# EAGLE design Bi Directional Visitor Counter (EAGLE 6.1)
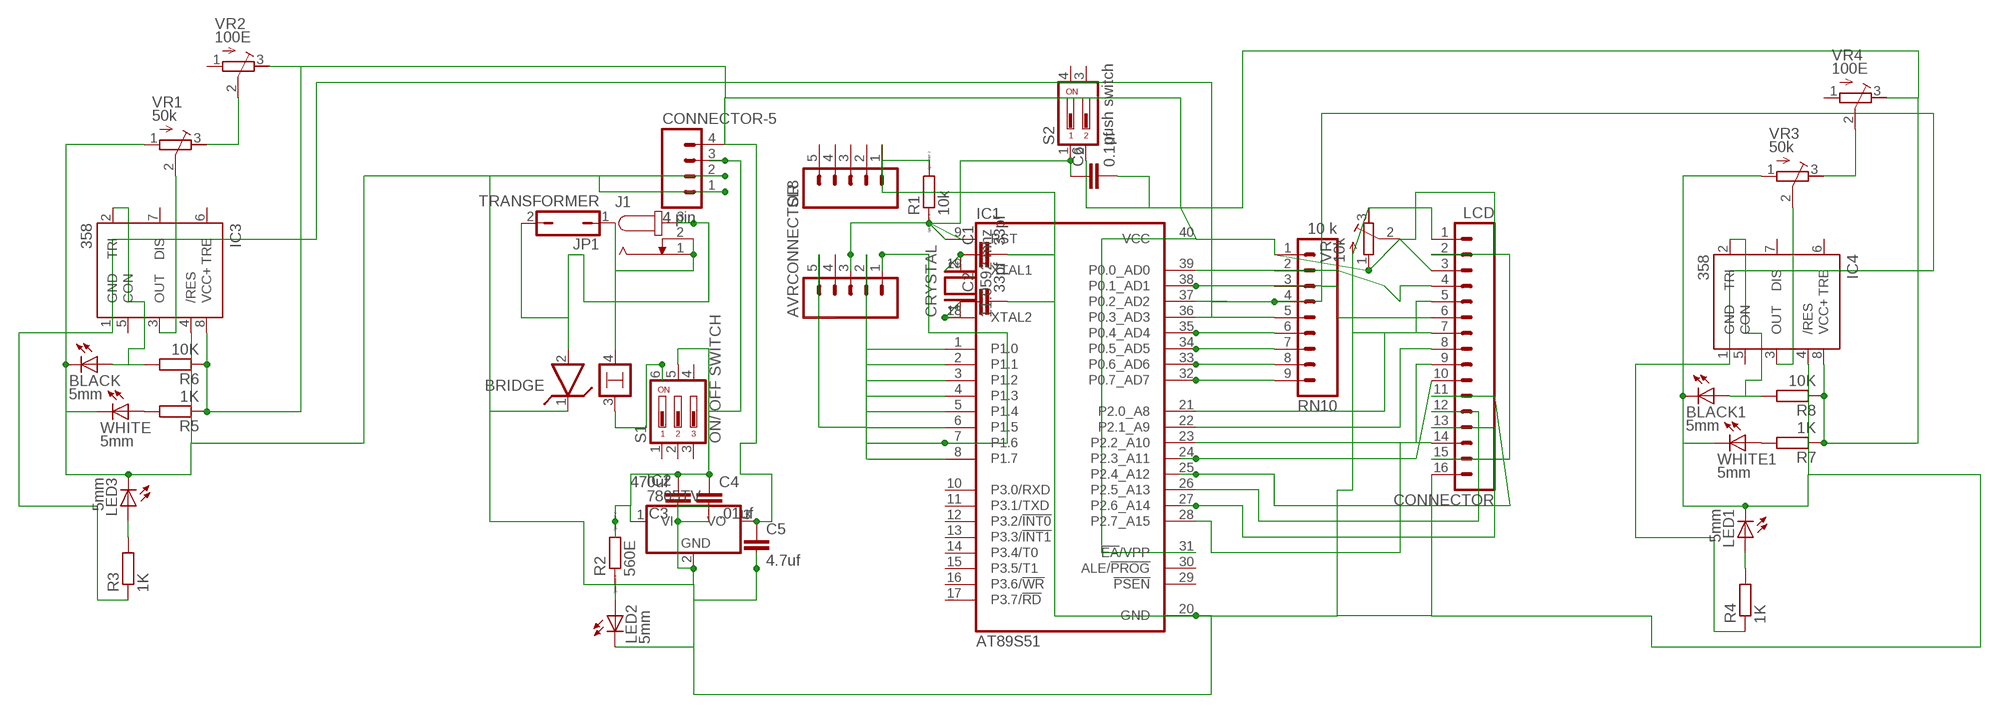
[diagram p0: schematic, sheet 1]

## Parts
AVRCONNECTOR  M05  [05P]
BLACK  5mm  LED5MM  [LED5MM]
BLACK1  5mm  LED5MM  [LED5MM]
BRIDGE  LM399H  [TO39/4]
C1  33pf  C-EU025-024X044  [C025-024X044]
C2  33pf  C-EU025-024X044  [C025-024X044]
C3  470uf  C5/7.2  [C5B7.2]
C4  .01uf  C2,5-3  [C2.5-3]
C5  4.7uf  C2,5-3  [C2.5-3]
C6  0.1uf  C2.5/6  [C2.5-6]
CONNECTOR  LCD  M16  [16P]
CONNECTOR-5  4 pin  M04  [04P]
CRYSTAL  11.0592 mhz  XTAL/S  [QS]
IC1  AT89S51  AT89C51-12PC  [DIL40]
IC2  7805TV  [TO220V]
IC3  358  NE555  [DIL-08]
IC4  358  NE555  [DIL-08]
J1  JACK-PLUG0  [SPC4077]
JP1  TRANSFORMER  JP1Q  [JP1]
LED1  5mm  LED5MM  [LED5MM]
LED2  5mm  LED5MM  [LED5MM]
LED3  5mm  LED5MM  [LED5MM]
R1  10k  R0204/7  [0204/7]
R2  560E  R0204/7  [0204/7]
R3  1K  R-EU_0204/7  [0204/7]
R4  1K  R-EU_0204/7  [0204/7]
R5  1K  R-EU_0204/7  [0204/7]
R6  10K  R-EU_0204/7  [0204/7]
R7  1K  R-EU_0204/7  [0204/7]
R8  10K  R-EU_0204/7  [0204/7]
RN10  10 k  M09  [09P]
S1  ON/ OFF SWITCH  DA03  [DA-03]
S2  push switch  DP02  [DP-02]
SL8  M05  [05P]
VR  10k  R-TRIMM64P  [RTRIM64P]
VR1  50k  R-TRIMM64P  [RTRIM64P]
VR2  100E  R-TRIMM64P  [RTRIM64P]
VR3  50k  R-TRIMM64P  [RTRIM64P]
VR4  100E  R-TRIMM64P  [RTRIM64P]
WHITE  5mm  LED5MM  [LED5MM]
WHITE1  5mm  LED5MM  [LED5MM]

## Nets
N$1: C2.1 CRYSTAL.1 IC1.18(XTAL2)
N$2: C1.1 CRYSTAL.2 IC1.19(XTAL1)
N$5: BRIDGE.2 J1.3 JP1.2
N$6: C3.2 C4.1 CONNECTOR-5.3 IC2.1(VI) R2.2 S1.5
N$8: C5.1 C6.2 CONNECTOR-5.4 CONNECTOR.2 CONNECTOR.15 IC1.31(!EA!/VPP) IC1.40(VCC) IC2.3(VO) IC3.8(VCC+) IC4.8(VCC+) R5.1 R6.1 R7.1 R8.1 RN10.1 S2.2 VR2.3(A) VR4.3(A) VR.1(E)
N$9: IC1.36(P0.3_AD3) IC3.1(GND) R3.1 RN10.5
N$10: R5.2 WHITE.A
N$11: BLACK.A IC3.2(TRI) R6.2
N$12: IC3.3(OUT) VR1.2(S)
N$13: VR1.3(A) VR2.2(S)
N$14: AVRCONNECTOR.3 C6.1 IC1.9(RST) R1.1 S2.1
N$15: AVRCONNECTOR.1 IC1.7(P1.6)
N$16: BRIDGE.4 J1.1 J1.2 JP1.1
N$17: IC1.5(P1.4)
N$18: IC1.4(P1.3)
N$19: IC1.3(P1.2)
N$20: IC1.2(P1.1)
N$21: IC1.1(P1.0)
N$23: LED3.A R3.2
N$26: IC1.35(P0.4_AD4) RN10.6
N$27: IC1.34(P0.5_AD5) RN10.7
N$28: IC1.33(P0.6_AD6) RN10.8
N$29: IC1.32(P0.7_AD7) RN10.9
N$30: CONNECTOR.7 IC1.21(P2.0_A8)
N$31: CONNECTOR.8 IC1.22(P2.1_A9)
N$32: CONNECTOR.9 IC1.23(P2.2_A10)
N$34: IC1.37(P0.2_AD2) IC4.1(GND) R4.1 RN10.4
N$35: CONNECTOR.12 IC1.26(P2.5_A13)
N$36: R7.2 WHITE1.A
N$37: BLACK1.A IC4.2(TRI) R8.2
N$38: CONNECTOR.3 VR.2(S)
N$40: IC4.3(OUT) VR3.2(S)
N$41: BLACK1.K(C) BLACK.K(C) BRIDGE.1 C1.2 C2.2 C3.1 C4.2 C5.2 CONNECTOR-5.1 CONNECTOR-5.2 CONNECTOR.1 CONNECTOR.5 CONNECTOR.16 IC1.20(GND) IC2.2(GND) IC3.4(/RES) IC4.4(/RES) LED1.K(C) LED2.K(C) LED3.K(C) R1.2 SL8.1 VR1.1(E) VR3.1(E) VR.3(A) WHITE1.K(C) WHITE.K(C)
N$42: AVRCONNECTOR.5 IC1.6(P1.5)
N$43: LED2.A R2.1
N$44: VR3.3(A) VR4.2(S)
N$45: AVRCONNECTOR.2 IC1.8(P1.7)
N$47: BRIDGE.3 S1.6
N$48: CONNECTOR.6 IC1.38(P0.1_AD1) RN10.3
N$50: LED1.A R4.2
N$51: CONNECTOR.10 IC1.24(P2.3_A11)
N$52: CONNECTOR.11 IC1.25(P2.4_A12)
N$54: CONNECTOR.13 IC1.27(P2.6_A14)
N$55: CONNECTOR.14 IC1.28(P2.7_A15)
N$58: CONNECTOR.4 IC1.39(P0.0_AD0) RN10.2
Unconnected: AVRCONNECTOR.4 IC1.10(P3.0/RXD) IC1.11(P3.1/TXD) IC1.12(P3.2/!INT0) IC1.13(P3.3/!INT1) IC1.14(P3.4/T0) IC1.15(P3.5/T1) IC1.16(P3.6/!WR) IC1.17(P3.7/!RD) IC1.29(!PSEN) IC1.30(ALE/!PROG) IC3.5(CON) IC3.6(TRE) IC3.7(DIS) IC4.5(CON) IC4.6(TRE) IC4.7(DIS) S1.1 S1.2 S1.3 S1.4 S2.3 S2.4 SL8.2 SL8.3 SL8.4 SL8.5 VR2.1(E) VR4.1(E)

## Library data of the parts
AVRCONNECTOR SL8 = con-amp-quick:M05: AMP QUICK CONNECTOR; OC_FARNELL: unknown; OC_NEWARK: unknown
BLACK BLACK1 LED1-LED3 WHITE WHITE1 = led:LED: LED OSRAM: - CHIPLED LG R971, LG N971, LY N971, LG Q971, LY Q971, LO R971, LY R971 LH N974, LH R974 LS Q976, LO Q976, LY Q976 LO Q996 - Hyper CHIPLED LW Q18S LB Q993, LB Q99A, LB R99A - SideLED LS A670, LO A670, LY A670, LG A670, LP A670 LB A673, LV A673, LT A673, LW A673 LH A674 LY A675 LS A676, LA A676, LO A676, LY A676, LW A676 LS A679, LY A679, LG A679 - Hyper Micro SIDELED® LS Y876, LA Y876, LO Y876, LY Y876 LT Y87S - SmartLED LW L88C, LW L88S LB L89C, LB L89S, LG L890 LS L89K, LO L89K, LY L89K LS L896, LA L896, LO L896, LY L896 - TOPLED LS T670, LO T670, LY T670, LG T670, LP T670 LSG T670, LSP T670, LSY T670, LOP T670, LYG T670 LG T671, LOG T671, LSG T671 LB T673, LV T673, LT T673, LW T673 LH T674 LS T676, LA T676, LO T676, LY T676, LB T676, LH T676, LSB T676, LW T676 LB T67C, LV T67C, LT T67C, LS T67K, LO T67K, LY T67K, LW E67C LS E67B, LA E67B, LO E67B, LY E67B, LB E67C, LV E67C, LT E67C LW T67C LS T679, LY T679, LG T679 LS T770, LO T770, LY T770, LG T770, LP T770 LB T773, LV T773, LT T773, LW T773 LH T774 LS E675, LA E675, LY E675, LS T675 LS T776, LA T776, LO T776, LY T776, LB T776 LHGB T686 LT T68C, LB T68C - Hyper Mini TOPLED® LB M676 - Mini TOPLED Santana® LG M470 LS M47K, LO M47K, LY M47K Source: http://www.osram.convergy.de LUXEON: - LUMILED® LXK2-PW12-R00, LXK2-PW12-S00, LXK2-PW14-U00, LXK2-PW14-V00 LXK2-PM12-R00, LXK2-PM12-S00, LXK2-PM14-U00 LXK2-PE12-Q00, LXK2-PE12-R00, LXK2-PE12-S00, LXK2-PE14-T00, LXK2-PE14-U00 LXK2-PB12-K00, LXK2-PB12-L00, LXK2-PB12-M00, LXK2-PB14-N00, LXK2-PB14-P00, LXK2-PB14-Q00 LXK2-PR12-L00, LXK2-PR12-M00, LXK2-PR14-Q00, LXK2-PR14-R00 LXK2-PD12-Q00, LXK2-PD12-R00, LXK2-PD12-S00 LXK2-PH12-R00, LXK2-PH12-S00 LXK2-PL12-P00, LXK2-PL12-Q00, LXK2-PL12-R00 Source: www.luxeon.com KINGBRIGHT: KA-3528ASYC Source: www.kingbright.com
BRIDGE = linear:LM399H: Precision Z DIODE
C1 C2 = rcl:C-EU: CAPACITOR, European symbol
C3-C6 = capacitor-wima:C: CAPACITOR naming: grid - package width
CONNECTOR = con-amp-quick:M16: AMP QUICK CONNECTOR; OC_FARNELL: unknown; OC_NEWARK: unknown
CONNECTOR-5 = con-amp-quick:M04: AMP QUICK CONNECTOR; OC_FARNELL: unknown; OC_NEWARK: unknown
CRYSTAL = special:XTAL/S: CRYSTAL
IC1 = atmel:AT89C51-*: 8-bit Microcontroller with 4K Bytes Flash Not Recommended for New Designs. Use AT89S51. Source: http://www.atmel.com/dyn/resources/prod_documents/doc0265.; OC_FARNELL: unknown; OC_NEWARK: unknown
IC2 = linear:78*: Positive VOLTAGE REGULATOR Source: http://cache.national.com/ds/LM/LM78L05.pdf http://www.fairchildsemi.com/ds/LM/LM7805.pdf
IC3 IC4 = st-microelectronics:NE555: General purpose bipolar Timer; MF: Arrow Electronics; MPN: NE555N; OC_FARNELL: 1467742; OC_NEWARK: 89K1486
J1 = con-jack:JACK-PLUG: DC POWER JACK Power Jack, DC, Right Angle, Through Hole, Rated 5A at 16VDC, PC Terminals Distributor: Farnell (www.Farnell.de) Drawing: 84N1161.pdf / 84N1162.pdf Manufacturer: SPC Technology (www.spctechnology.com) Type: SPC4077 / SPC 4078; OC_FARNELL: unknown; OC_NEWARK: unknown
JP1 = jumper:JP1Q: JUMPER
R1 R2 = eagle-ltspice:R: RESISTOR, European symbol; SPICEMODEL: NONE; SPICEPREFIX: R
R3-R8 = rcl:R-EU_: RESISTOR, European symbol
RN10 = con-amp-quick:M09: AMP QUICK CONNECTOR; OC_FARNELL: unknown; OC_NEWARK: unknown
S1 = switch-dil:DA03: DIL/CODE SWITCH; MPN: MCDA03; OC_FARNELL: 1521999; OC_NEWARK: 74M2972
S2 = switch-dil:DP02: DIL/CODE SWITCH; MPN: MCDP02; OC_FARNELL: 1255233; OC_NEWARK: 26M1095
VR VR1-VR4 = resistor:R-TRIMM: Trimm resistor

## Board
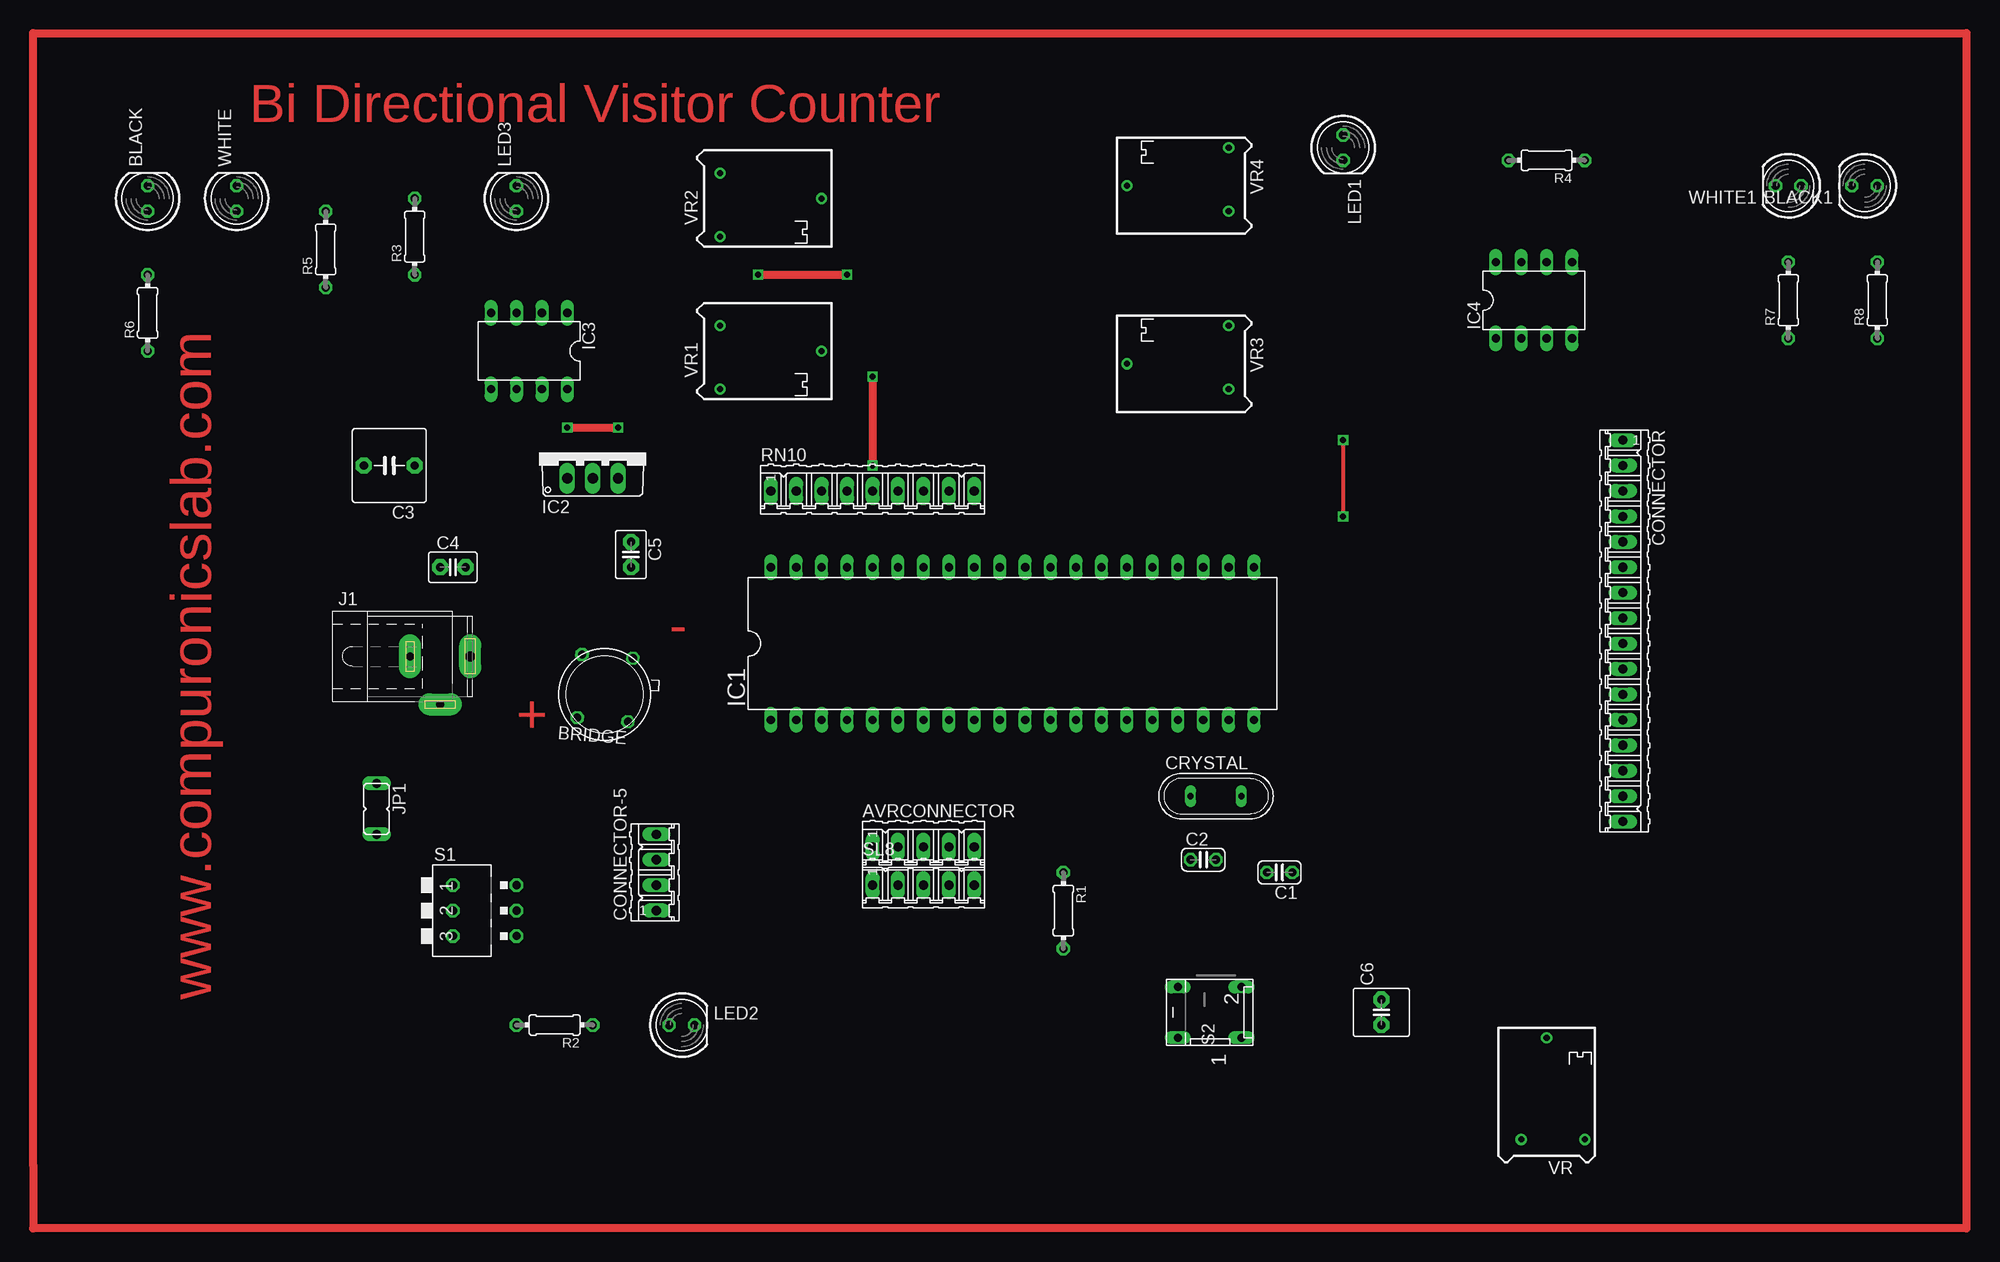
[diagram p1: board, top side]
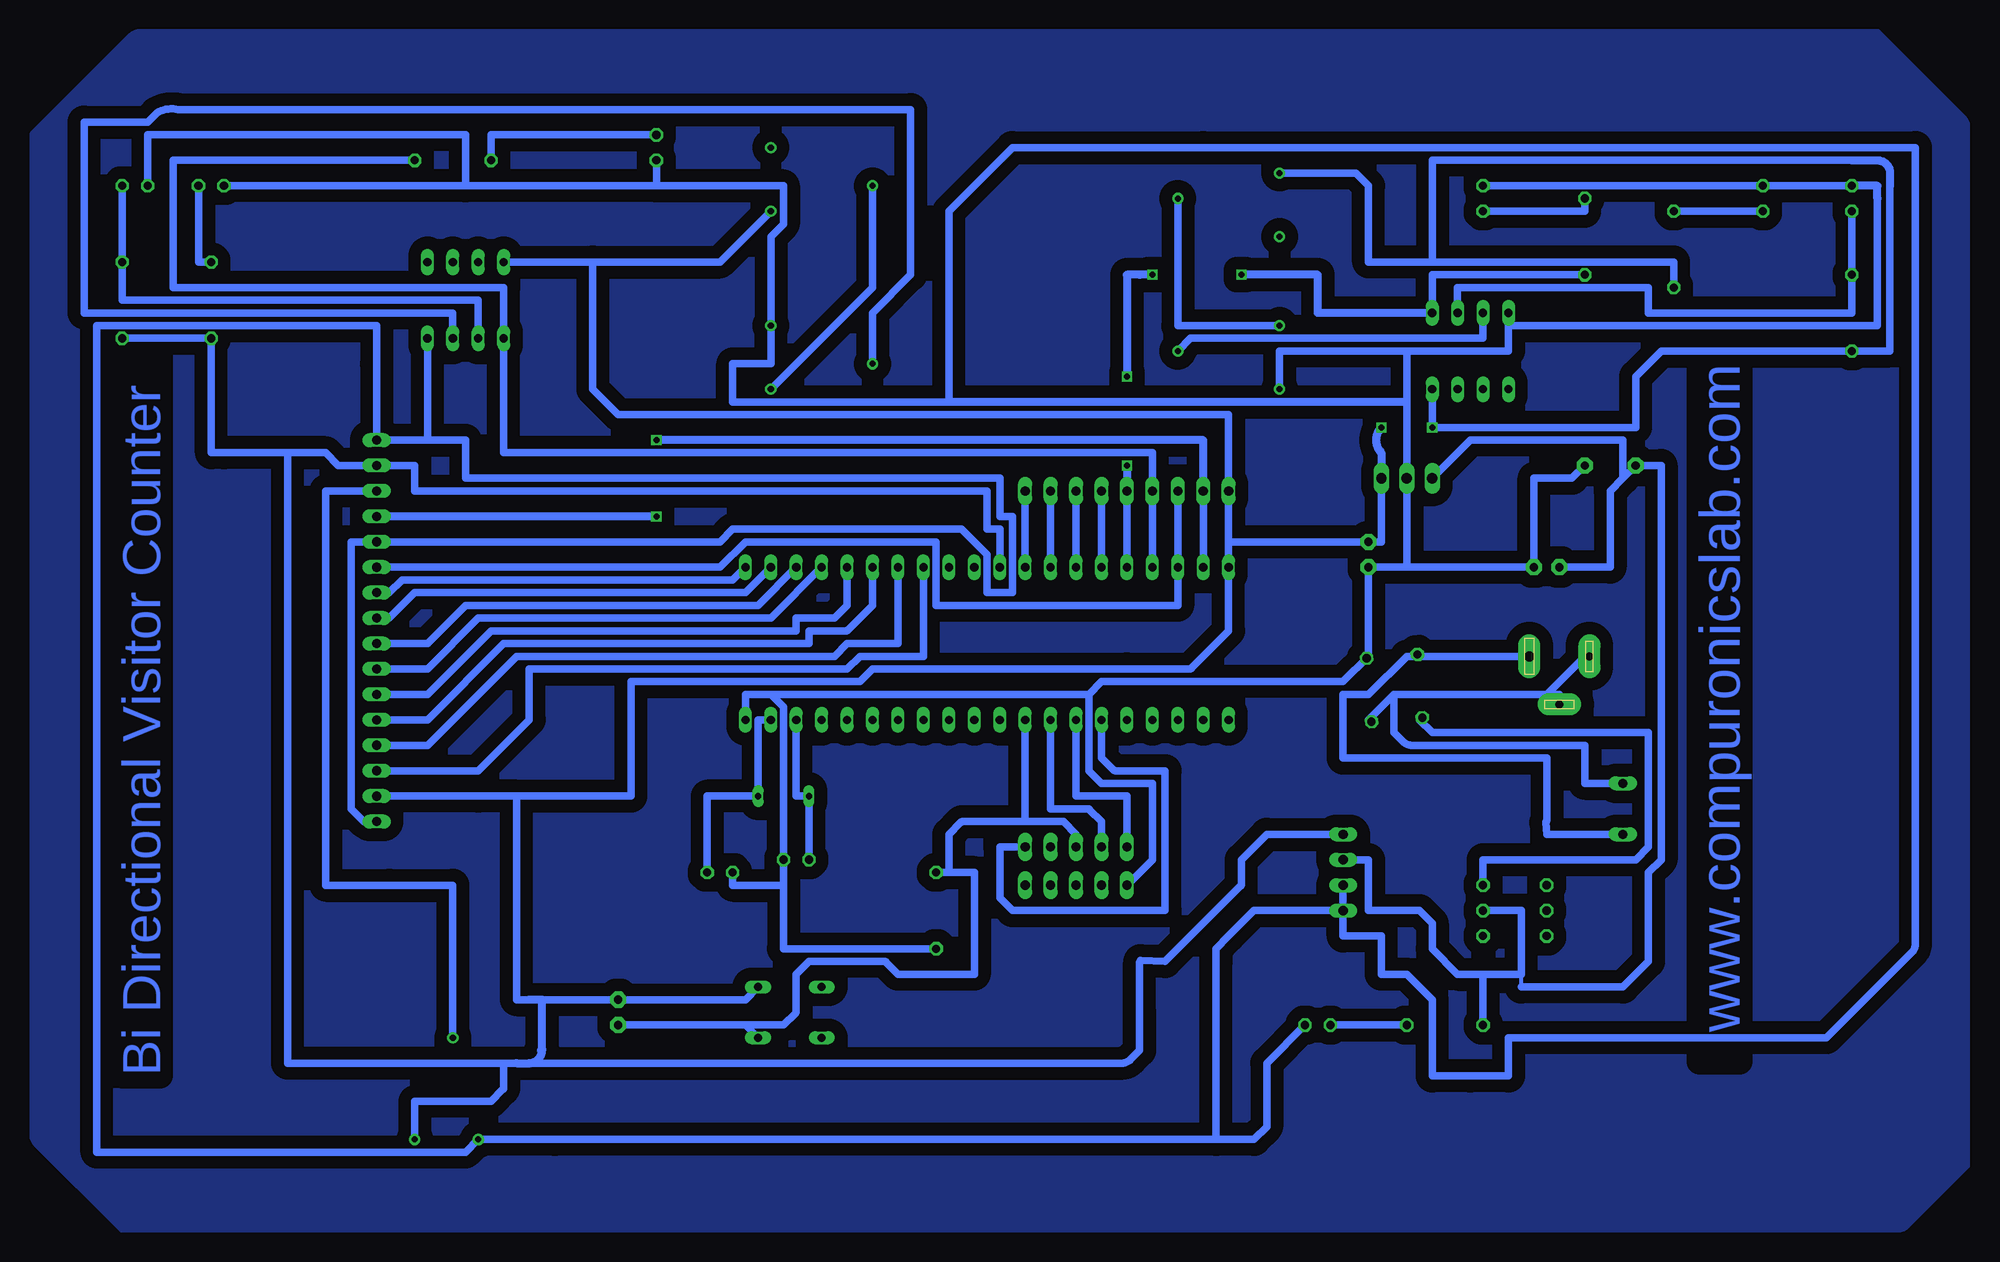
[diagram p2: board, bottom side, seen from below]

No outline drawn. Coordinates in mm, seen from the top.
Copper layers (1*16): Top 0.035mm / dielectric 1.5mm / Bottom 0.035mm
Design rules: minimum track width 30mil, minimum drill 24mil, track to track 20mil, track to pad 8mil, pad to pad 8mil, via to via 8mil, smd to smd 8mil, copper to edge 20mil, drill to drill 8mil, minimum pad ring 10mil, minimum via ring 8mil, stop-mask expansion 8mil, vias tented up to drill 0mil, thermal gap 20mil

### Footprints (pad centres in the part's own frame; a part is rotated, then mirrored left to right if it is on the bottom)
05P = drill 0.914 long: 1 -5.08,0; 2 -2.54,0; 3 0,0; 4 2.54,0; 5 5.08,0
LED5MM = drill 0.813 octagon: A -1.27,0; K 1.27,0
TO39/4 = drill 0.813 octagon: 1 -2.54,-2.54; 2 2.54,-2.54; 3 2.54,3.81; 4 -2.54,3.81
C025-024X044 = drill 0.813 octagon: 1 -1.27,0; 2 1.27,0
C5B7.2 = drill 0.813 pad 1.6 octagon: 1 -2.54,0; 2 2.54,0
C2.5-3 = drill 0.813 pad 1.6 octagon: 1 -1.27,0; 2 1.27,0
C2.5-6 = drill 0.813 pad 1.6 octagon: 1 -1.27,0; 2 1.27,0
16P = drill 0.914 long: 1 -19.05,0; 2 -16.51,0; 3 -13.97,0; 4 -11.43,0; 5 -8.89,0; 6 -6.35,0; 7 -3.81,0; 8 -1.27,0; 9 1.27,0; 10 3.81,0; 11 6.35,0; 12 8.89,0; 13 11.43,0; 14 13.97,0; 15 16.51,0; 16 19.05,0
04P = drill 0.914 long: 1 -3.81,0; 2 -1.27,0; 3 1.27,0; 4 3.81,0
QS = drill 0.61 long: 1 -2.54,0; 2 2.54,0
DIL40 = drill 0.813 long: 1 -24.13,-7.62; 2 -21.59,-7.62; 3 -19.05,-7.62; 4 -16.51,-7.62; 5 -13.97,-7.62; 6 -11.43,-7.62; 7 -8.89,-7.62; 8 -6.35,-7.62; 9 -3.81,-7.62; 10 -1.27,-7.62; 11 1.27,-7.62; 12 3.81,-7.62; 13 6.35,-7.62; 14 8.89,-7.62; 15 11.43,-7.62; 16 13.97,-7.62; 17 16.51,-7.62; 18 19.05,-7.62; 19 21.59,-7.62; 20 24.13,-7.62; 21 24.13,7.62; 22 21.59,7.62; 23 19.05,7.62; 24 16.51,7.62; 25 13.97,7.62; 26 11.43,7.62; 27 8.89,7.62; 28 6.35,7.62; 29 3.81,7.62; 30 1.27,7.62; 31 -1.27,7.62; 32 -3.81,7.62; 33 -6.35,7.62; 34 -8.89,7.62; 35 -11.43,7.62; 36 -13.97,7.62; 37 -16.51,7.62; 38 -19.05,7.62; 39 -21.59,7.62; 40 -24.13,7.62
TO220V = drill 1.016 long: 1 -2.54,-2.54; 2 0,-2.54; 3 2.54,-2.54
DIL-08 = drill 0.813 long: 1 -3.81,-3.81; 2 -1.27,-3.81; 3 1.27,-3.81; 4 3.81,-3.81; 5 3.81,3.81; 6 1.27,3.81; 7 -1.27,3.81; 8 -3.81,3.81
SPC4077 = drill 0.8 pad 2.184 long: 1 -3,0; 2 0,-4.8 | drill 1 pad 2.184 long: 3 3,0
JP1 = drill 0.914 long: 1 0,-2.54; 2 0,2.54
0204/7 = drill 0.813 octagon: 1 -3.81,0; 2 3.81,0
09P = drill 0.914 long: 1 -10.16,0; 2 -7.62,0; 3 -5.08,0; 4 -2.54,0; 5 0,0; 6 2.54,0; 7 5.08,0; 8 7.62,0; 9 10.16,0
DA-03 = drill 0.813 octagon: 1 -2.54,-5.08; 2 0,-5.08; 3 2.54,-5.08; 4 2.54,1.27; 5 0,1.27; 6 -2.54,1.27
DP-02 = drill 0.813 long: 1 -2.54,-2.54; 2 2.54,-2.54; 3 2.54,3.81; 4 -2.54,3.81
RTRIM64P = drill 0.61: 1 -2.54,-3.81; 2 7.62,0; 3 -2.54,2.54

### Placement (x,y rotation side)
AVRCONNECTOR  0,-36.83 0 top
BLACK  -77.47,27.94 90 top
BLACK1  93.98,29.21 180 top
BRIDGE  -31.75,-20.32 175.6 top
C1  35.56,-39.37 180 top
C2  27.94,-38.1 0 top
C3  -53.34,1.27 180 top
C4  -46.99,-8.89 0 top
C5  -29.21,-7.62 270 top
C6  45.72,-53.34 90 top
CONNECTOR  69.85,-15.24 270 top
CONNECTOR-5  -26.67,-39.37 90 top
CRYSTAL  29.21,-31.75 0 top
IC1  8.89,-16.51 0 top
IC2  -33.02,2.54 0 top
IC3  -39.37,12.7 180 top
IC4  60.96,17.78 0 top
J1  -48.26,-17.78 0 top
JP1  -54.61,-33.02 180 top
LED1  41.91,33.02 270 top
LED2  -24.13,-54.61 0 top
LED3  -40.64,27.94 90 top
R1  13.97,-43.18 270 top
R2  -36.83,-54.61 180 top
R3  -50.8,24.13 90 top
R4  62.23,31.75 180 top
R5  -59.69,22.86 90 top
R6  -77.47,16.51 90 top
R7  86.36,17.78 90 top
R8  95.25,17.78 90 top
RN10  -5.08,-1.27 0 top
S1  -41.91,-43.18 270 top
S2  29.21,-53.34 90 top
SL8  0,-40.64 0 top
VR  62.23,-63.5 90 top
VR1  -17.78,12.7 0 top
VR2  -17.78,27.94 0 top
VR3  27.94,11.43 180 top
VR4  27.94,29.21 180 top
WHITE  -68.58,27.94 90 top
WHITE1  86.36,29.21 180 top

### Tracks (layer width: path | path; a pad name or v marks a point on that pad's centre or on a via)
N$1
  Bottom 0.762: C2.1 CRYSTAL.1 27.94,-31.75 IC1.18
N$2
  Bottom 0.762: IC1.19 31.75,-24.13 CRYSTAL.2 36.83,-31.75 C1.1
N$3
  Top 0.813: -88.9,-68.58 -88.9,-74.93 104.14,-74.93 104.14,44.45 -88.9,44.45 -88.9,-68.58
N$4
  pour Bottom (isolate 1.27, no thermals): -73.66,-74.93 -74.93,-74.93 -82.02,-74.93 arc-45 -82.92,-74.56 -88.9,-68.58 -88.9,35.03 arc-45 -88.53,35.93 -80.01,44.45 93.45,44.45 arc-45 94.35,44.08 104.14,34.29 104.14,-65.51 arc-45 103.77,-66.41 95.25,-74.93
N$5
  Bottom 0.762: -34.29,-17.78 -44.45,-17.78 J1.3 | -34.29,-17.78 BRIDGE.2 -34.29,-17.78 | JP1.2 -46.99,-35.56 -46.9,-34.38 arc-45 -46.99,-34.16 -46.99,-27.94 -30.48,-27.94 -26.67,-27.94 -26.67,-24.13 -26.67,-21.59 -29.21,-21.59 -33.02,-17.78 -34.29,-17.78
N$6
  Bottom 0.406: -44.45,-50.8 -44.45,-49.53 | -44.45,-49.53 -44.45,-48.26 -44.45,-49.53
  Bottom 0.762: -41.91,-49.53 -38.1,-49.53 -35.56,-46.99 -35.56,-44.45 -34.29,-43.18 -29.21,-43.18 -29.21,-38.1 CONNECTOR-5.3 | -41.91,-49.53 -40.64,-49.53 R2.2 | S1.5 -44.45,-43.18 -44.45,-48.26 -44.45,-49.53 -41.91,-49.53 | C4.1 -53.34,-8.89 -53.34,-1.27 -54.61,0 | -54.61,0 C3.2 -58.42,1.27 -58.42,-38.1 -57.15,-39.37 -57.15,-45.72 -57.15,-48.26 -54.61,-50.8 -44.45,-50.8 | IC2.1 -39.37,3.81 -54.61,3.81 -54.61,0
N$8  (via drill 0.6)
  Top 0.813: v-35.56,5.08 v-30.48,5.08
  Bottom 0.762: VR2.3 -27.94,30.48 -29.21,29.21 -29.21,21.59 -35.56,21.59 | -35.56,21.59 -59.69,21.59 R5.1 | IC3.8 v-35.56,5.08 -55.88,5.08 -55.88,10.16 -58.42,12.7 R6.1 -81.28,12.7 -81.28,29.21 | -35.56,21.59 -35.56,31.75 -43.18,31.75 -77.47,31.75 | -15.24,-6.35 RN10.1 -15.24,6.35 33.02,6.35 45.72,6.35 48.26,8.89 48.26,21.59 | -15.24,-6.35 IC1.40 -15.24,-15.24 -11.52,-18.96 arc45 -11.3,-19.05 -5.08,-19.05 20.32,-19.05 21.59,-20.32 34.29,-20.32 44.45,-20.32 44.45,-31.75 55.88,-31.75 | IC2.3 -30.48,-1.27 -30.48,-6.35 C5.1 -15.24,-6.35 | VR4.3 35.56,21.59 48.26,21.59 | IC4.8 48.26,21.59 | R8.1 R7.1 86.36,3.81 86.36,2.54 85.09,2.54 74.93,2.54 | IC1.31 7.62,-5.08 8.89,-5.08 8.89,-1.27 12.7,-1.27 66.04,-1.27 66.04,1.27 68.58,1.27 CONNECTOR.2 73.66,1.27 74.93,2.54 | 55.88,-58.42 57.15,-58.42 | 57.15,-58.42 57.15,-60.83 arc45 57.24,-61.05 58.42,-62.23 66.04,-62.23 VR.1 | 48.26,-52.07 C6.2 33.02,-52.07 S2.2 | 48.26,-52.07 52.07,-52.07 | CONNECTOR-5.4 -19.05,-35.56 -16.51,-38.1 -16.51,-40.51 arc45 -16.42,-40.73 -8.89,-48.26 -6.44,-48.17 arc-45 -6.35,-48.39 -6.35,-53.34 | -6.35,-53.34 -6.35,-57.15 | -6.35,-57.15 -6.35,-53.34 | 57.15,-58.42 55.88,-58.42 | 55.88,-58.42 -4.55,-58.42 arc-45 -5.45,-58.05 -6.35,-57.15 | -6.35,-57.15 -6.35,-53.34 | CONNECTOR.15 68.58,-31.75 59.69,-31.75 55.88,-31.75 | 48.26,-52.07 53.34,-52.07 | 53.34,-52.07 55.88,-52.07 | 55.88,-52.07 53.34,-52.07 | 53.34,-52.07 55.88,-52.07 | 55.88,-52.07 55.88,-41.91 | 55.88,-41.91 55.88,-31.75 | 74.93,2.54 78.74,2.54 78.74,-1.27 78.74,-58.42 57.15,-58.42 | 55.88,-41.91 55.88,-31.75
  Bottom 0.813: -77.47,31.75 -80.01,31.75 arc90 -81.28,30.48 -81.28,29.21 | 54.61,-52.07 53.34,-52.07 53.34,-57.15 arc90 54.61,-58.42 55.88,-58.42 | v-30.48,5.08 arc-90 -30.48,2.54 -30.48,-1.27
N$9  (via drill 0.6)
  Top 0.813: v-16.51,20.32 v-7.62,20.32 | v-5.08,10.16 v-5.08,1.27
  Bottom 0.762: RN10.5 IC1.36 | R3.1 -35.56,20.32 IC3.1
  Bottom 0.813: IC3.1 -24.13,16.51 -24.13,20.32 v-16.51,20.32 | v-7.62,20.32 -6.35,20.32 -5.08,20.32 v-5.08,10.16 | v-5.08,1.27 RN10.5
N$10
  Bottom 0.762: R5.2 WHITE.A
N$11
  Bottom 0.762: BLACK.A R6.2 -77.47,16.51 -73.66,16.51 -57.15,16.51 -57.15,19.05 -38.1,19.05 IC3.2
N$12
  Bottom 0.762: VR1.2 -11.43,13.97 -40.64,13.97 IC3.3
N$13
  Bottom 0.762: VR1.3 -10.16,15.24 VR2.2
N$14
  Bottom 0.762: 33.02,-54.61 S2.1 | C6.1 33.02,-54.61 | 5.08,-34.29 IC1.9 | 5.08,-34.29 8.89,-34.29 11.3,-34.29 arc-45 11.52,-34.38 12.7,-35.56 12.7,-39.37 10.16,-39.37 | R1.1 10.16,-39.37 | AVRCONNECTOR.3 0,-35.56 1.27,-34.29 5.08,-34.29 | 33.02,-54.61 29.21,-54.61 28.03,-53.43 arc-45 27.94,-53.21 27.94,-49.53 26.67,-48.26 19.18,-48.26 arc45 18.96,-48.35 17.78,-49.53 10.16,-49.53 10.16,-39.37
N$15
  Bottom 0.762: IC1.7 0,-31.75 -1.27,-31.75 -5.08,-31.75 -5.08,-35.56 AVRCONNECTOR.1
N$16
  Bottom 0.762: -31.75,-21.59 -30.48,-22.86 | -30.48,-22.86 -29.21,-24.13 BRIDGE.4 | -46.99,-21.59 -48.26,-21.59 J1.2 -46.99,-21.59 | -46.99,-21.59 -31.75,-21.59 | JP1.1 -50.8,-30.48 -50.8,-26.67 -34.29,-26.67 -33.55,-26.67 arc45 -32.65,-26.3 -31.75,-25.4 -31.75,-21.59 | -30.48,-22.86 -31.75,-21.59 | -46.99,-21.59 -50.8,-17.78 J1.1
N$23
  Bottom 0.762: LED3.A -50.8,26.67 R3.2
N$26
  Bottom 0.762: RN10.6 IC1.35
N$27
  Bottom 0.762: RN10.7 IC1.34
N$28
  Bottom 0.762: RN10.8 IC1.33
N$29
  Bottom 0.762: RN10.9 IC1.32
N$30
  Bottom 0.762: IC1.21 34.29,-10.16 67.31,-10.16 68.58,-11.43 CONNECTOR.7
N$31
  Bottom 0.762: IC1.22 33.02,-11.43 66.04,-11.43 68.58,-13.97 CONNECTOR.8
N$32
  Bottom 0.762: IC1.23 31.75,-12.7 60.96,-12.7 64.77,-16.51 CONNECTOR.9
N$34
  Bottom 0.762: IC1.37 RN10.4 -7.62,0 -7.62,2.54 44.45,2.54 57.15,2.54 IC4.1 57.15,19.05 90.17,19.05 90.17,31.75 68.58,31.75 67.31,31.75 R4.1
N$35
  Bottom 0.762: IC1.26 20.32,-12.7 22.77,-15.15 arc45 22.99,-15.24 26.67,-15.24 26.67,-16.51 57.15,-16.51 64.77,-24.13 CONNECTOR.12
N$36
  Bottom 0.762: R7.2 87.63,21.59 WHITE1.A
N$37
  Bottom 0.762: IC4.2 59.69,17.78 95.25,17.78 R8.2 BLACK1.A
N$38
  Bottom 0.762: VR.2 62.23,-40.64 68.58,-40.64 74.93,-40.64 74.93,-34.29 74.93,-1.27 CONNECTOR.3
N$39
  Bottom 0.762: 53.25,-57.06 arc45 53.47,-57.15
N$40
  Bottom 0.762: VR3.2 20.32,16.51 16.51,20.32 16.51,36.83 89.64,36.83 arc-45 91.81,36.46 92.71,35.56 99.06,35.56 99.06,34.29 99.06,30.48 99.06,16.51 62.23,16.51 IC4.3
N$41
  Bottom 0.762: CONNECTOR.16 71.12,-34.29 72.39,-33.02 72.39,-6.35 CONNECTOR.5 35.56,-6.35 34.29,-5.08 11.43,-5.08 8.89,-7.62 8.89,-11.43 6.35,-11.43 6.35,-10.16 6.35,-3.81 7.62,-3.81 7.62,0 11.43,0 60.96,0 60.96,3.81 64.77,3.81 | 64.77,3.81 IC4.4 | 64.77,3.81 CONNECTOR.1 69.85,11.43 69.85,15.24 73.66,15.24 81.28,15.24 97.79,15.24 97.79,-67.31 96.52,-67.31 60.96,-67.31 VR.3 52.07,-66.04 -13.97,-66.04 | CONNECTOR-5.2 CONNECTOR-5.1 | -13.97,-66.04 -17.78,-66.04 -19.05,-64.77 -19.05,-58.42 LED2.K | -13.97,-66.04 -13.97,-48.26 -13.97,-46.99 -15.24,-45.72 -17.78,-43.18 CONNECTOR-5.1 | 41.91,29.21 29.21,29.21 | 29.21,29.21 29.21,25.4 30.48,24.13 VR3.1 30.48,11.43 34.29,11.43 34.29,7.62 12.7,7.62 12.7,26.67 6.35,33.02 -12.7,33.02 -83.82,33.02 -83.82,-17.78 -83.82,-46.46 arc45 -83.45,-47.36 -82.55,-48.26 -81.28,-49.53 -74.93,-55.88 -43.18,-55.88 -43.18,-59.69 -39.37,-59.69 -35.56,-59.69 -35.56,-55.88 -35.56,-52.07 -33.02,-49.53 -30.48,-49.53 -30.48,-45.72 -26.67,-45.72 CONNECTOR-5.1 | LED1.K 41.91,29.21 | 29.21,29.21 41.91,29.21 | 41.91,29.21 60.96,29.21 | 60.96,29.21 WHITE1.K | BLACK1.K 92.71,34.29 85.09,34.29 60.96,34.29 60.96,33.02 60.96,29.21 | R1.2 29.21,-46.99 29.21,-40.64 | C1.2 34.29,-40.64 29.21,-40.64 | 29.21,-40.64 C2.2 29.21,-22.86 30.48,-21.59 | IC1.20 33.02,-21.59 30.48,-21.59 | SL8.1 -7.62,-38.1 -7.62,-30.48 -6.35,-30.48 -2.54,-30.48 -1.36,-29.3 arc45 -1.27,-29.08 -1.27,-25.4 -1.27,-21.59 | 30.48,-21.59 -1.27,-21.59 | -29.21,-17.78 C5.2 -33.02,-8.89 | -29.21,-17.78 BRIDGE.1 -29.21,-17.78 | -33.02,-8.89 -36.83,-8.89 C4.2 -45.72,0 -49.53,0 C3.1 | BLACK.K WHITE.K -41.91,29.21 LED3.K
  Bottom 0.762: VR1.1 -20.32,12.7 -33.02,12.7 | -33.02,12.7 -43.18,12.7 IC3.4 -43.18,15.24 -80.01,15.24 -80.01,27.94 | -33.02,12.7 -33.02,7.62 IC2.2 -33.02,-8.89 | -1.27,-21.59 -2.54,-20.32 -26.67,-20.32 -29.21,-17.78
  Bottom 0.813: -33.02,7.62 12.7,7.62 | -80.01,27.94 -80.01,29.21 BLACK.K
N$42
  Bottom 0.762: IC1.6 -2.54,-27.94 -3.72,-29.12 arc-45 -3.94,-29.21 -7.62,-29.21 -8.89,-29.21 -8.89,-43.18 6.35,-43.18 7.62,-41.91 7.62,-36.83 AVRCONNECTOR.5
N$43
  Bottom 0.762: LED2.A R2.1
N$44
  Bottom 0.762: VR3.3 20.32,19.05 VR4.2
N$45
  Bottom 0.762: IC1.8 2.54,-33.02 0,-33.02 -1.14,-33.02 arc45 -1.36,-33.11 -2.54,-34.29 -2.54,-35.56 AVRCONNECTOR.2
N$47
  Bottom 0.762: S1.6 -40.64,-38.1 -43.18,-38.1 -55.88,-38.1 -57.15,-36.83 -57.15,-25.4 -35.56,-25.4 -34.29,-24.13 BRIDGE.3
N$48
  Bottom 0.762: RN10.3 IC1.38 -10.16,-12.7 -6.35,-12.7 13.97,-12.7 13.97,-7.62 13.97,-6.35 15.24,-6.35 33.02,-6.35 35.56,-8.89 CONNECTOR.6
N$50
  Bottom 0.762: LED1.A 58.42,34.29 R4.2
N$51
  Bottom 0.762: IC1.24 30.48,-13.97 59.69,-13.97 64.77,-19.05 CONNECTOR.10
N$52
  Bottom 0.762: IC1.25 22.86,-12.7 24.04,-13.88 arc45 24.26,-13.97 27.94,-13.97 27.94,-15.24 58.42,-15.24 64.77,-21.59 CONNECTOR.11
N$54
  Bottom 0.762: IC1.27 17.78,-16.51 22.86,-16.51 24.13,-17.78 55.88,-17.78 64.77,-26.67 CONNECTOR.13
N$55
  Bottom 0.762: IC1.28 15.24,-17.78 21.59,-17.78 22.86,-19.05 54.61,-19.05 54.61,-24.13 59.69,-29.21 64.77,-29.21 CONNECTOR.14
N$58  (via drill 0.6)
  Top 0.406: v41.91,3.81 v41.91,-3.81
  Bottom 0.762: RN10.2 IC1.39
  Bottom 0.813: RN10.2 -12.7,3.81 v41.91,3.81 | v41.91,-3.81 45.72,-3.81 CONNECTOR.4

### Text on the board
Top: Bi Directional Visitor Counter | - | + | www.compuronicslab.com
Bottom: www.compuronicslab.com | Bi Directional Visitor Counter